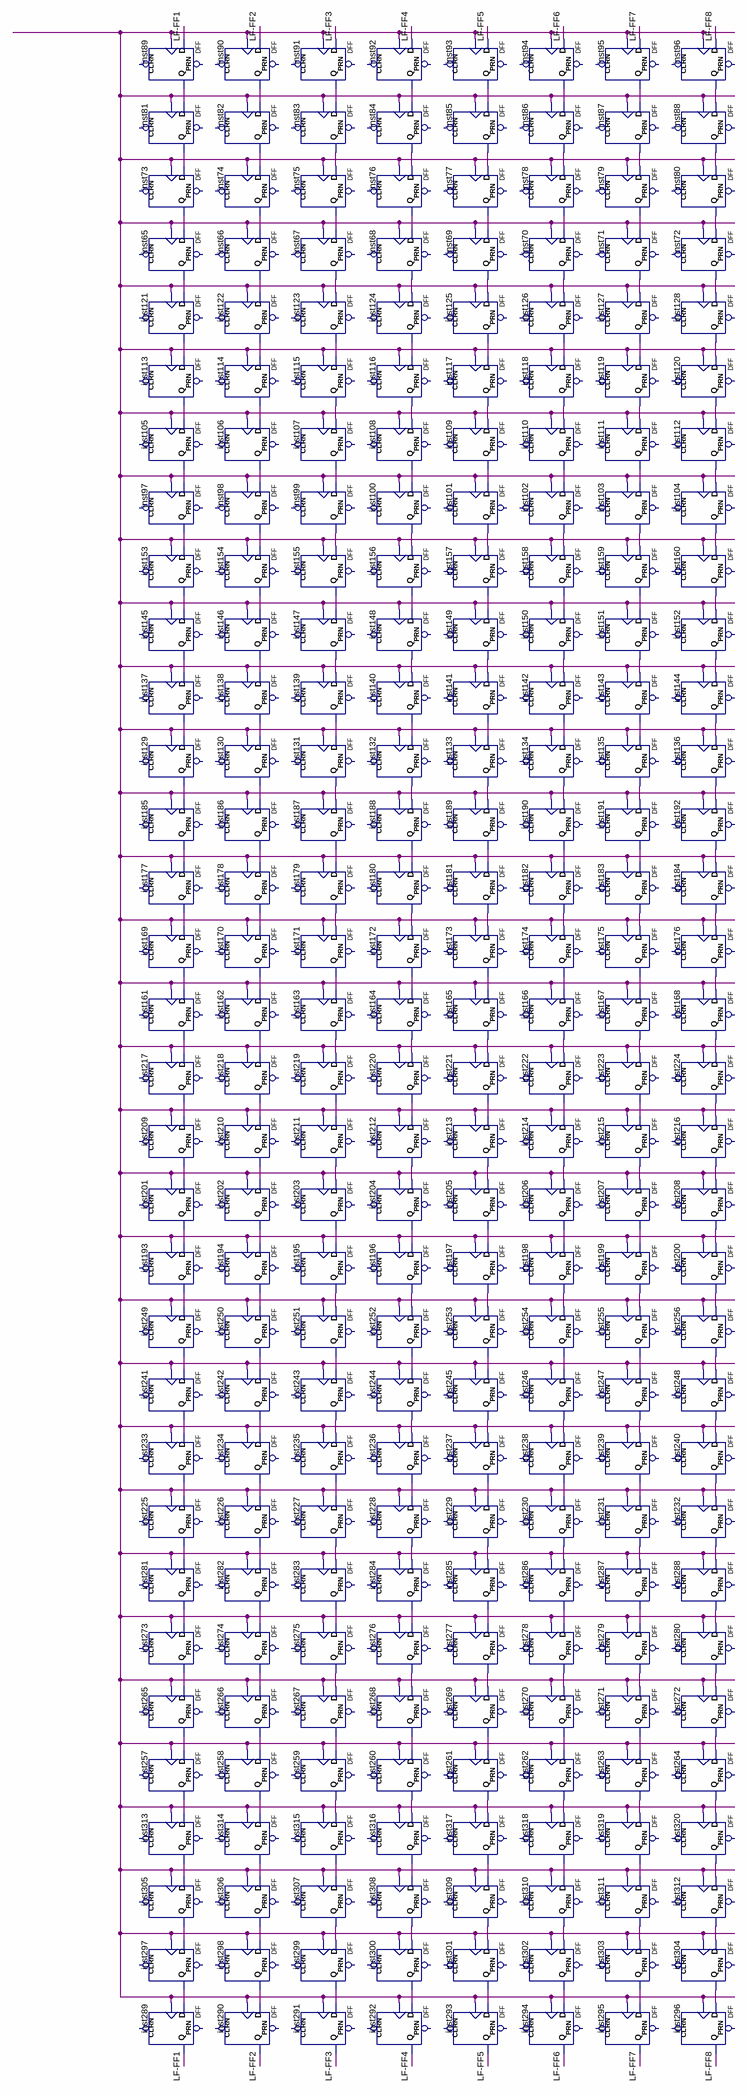
[diagram p0: schematic sheet]
// Quartus schematic Pistabdf.bdf as structural Verilog: 256 symbols, 0 pins
module Pistabdf (
);

  wire inst65_q, inst66_q, inst67_q, inst68_q, inst69_q, inst70_q, inst71_q, inst72_q, inst73_q, inst74_q,
       inst75_q, inst76_q, inst77_q, inst78_q, inst79_q, inst80_q, inst81_q, inst82_q, inst83_q, inst84_q,
       inst85_q, inst86_q, inst87_q, inst88_q, inst89_q, inst90_q, inst91_q, inst92_q, inst93_q, inst94_q,
       inst95_q, inst96_q, inst97_q, inst98_q, inst99_q, inst100_q, inst101_q, inst102_q, inst103_q,
       inst104_q, inst105_q, inst106_q, inst107_q, inst108_q, inst109_q, inst110_q, inst111_q, inst112_q,
       inst113_q, inst114_q, inst115_q, inst116_q, inst117_q, inst118_q, inst119_q, inst120_q, inst121_q,
       inst122_q, inst123_q, inst124_q, inst125_q, inst126_q, inst127_q, inst128_q, inst129_q, inst130_q,
       inst131_q, inst132_q, inst133_q, inst134_q, inst135_q, inst136_q, inst137_q, inst138_q, inst139_q,
       inst140_q, inst141_q, inst142_q, inst143_q, inst144_q, inst145_q, inst146_q, inst147_q, inst148_q,
       inst149_q, inst150_q, inst151_q, inst152_q, inst153_q, inst154_q, inst155_q, inst156_q, inst157_q,
       inst158_q, inst159_q, inst160_q, inst161_q, inst162_q, inst163_q, inst164_q, inst165_q, inst166_q,
       inst167_q, inst168_q, inst169_q, inst170_q, inst171_q, inst172_q, inst173_q, inst174_q, inst175_q,
       inst176_q, inst177_q, inst178_q, inst179_q, inst180_q, inst181_q, inst182_q, inst183_q, inst184_q,
       inst185_q, inst186_q, inst187_q, inst188_q, inst189_q, inst190_q, inst191_q, inst192_q, inst193_q,
       inst194_q, inst195_q, inst196_q, inst197_q, inst198_q, inst199_q, inst200_q, inst201_q, inst202_q,
       inst203_q, inst204_q, inst205_q, inst206_q, inst207_q, inst208_q, inst209_q, inst210_q, inst211_q,
       inst212_q, inst213_q, inst214_q, inst215_q, inst216_q, inst217_q, inst218_q, inst219_q, inst220_q,
       inst221_q, inst222_q, inst223_q, inst224_q, inst225_q, inst226_q, inst227_q, inst228_q, inst229_q,
       inst230_q, inst231_q, inst232_q, inst233_q, inst234_q, inst235_q, inst236_q, inst237_q, inst238_q,
       inst239_q, inst240_q, inst241_q, inst242_q, inst243_q, inst244_q, inst245_q, inst246_q, inst247_q,
       inst248_q, inst249_q, inst250_q, inst251_q, inst252_q, inst253_q, inst254_q, inst255_q, inst256_q,
       inst257_q, inst258_q, inst259_q, inst260_q, inst261_q, inst262_q, inst263_q, inst264_q, inst265_q,
       inst266_q, inst267_q, inst268_q, inst269_q, inst270_q, inst271_q, inst272_q, inst273_q, inst274_q,
       inst275_q, inst276_q, inst277_q, inst278_q, inst279_q, inst280_q, inst281_q, inst282_q, inst283_q,
       inst284_q, inst285_q, inst286_q, inst287_q, inst288_q, inst297_q, inst298_q, inst299_q, inst300_q,
       inst301_q, inst302_q, inst303_q, inst304_q, inst305_q, inst306_q, inst307_q, inst308_q, inst309_q,
       inst310_q, inst311_q, inst312_q, inst313_q, inst314_q, inst315_q, inst316_q, inst317_q, inst318_q,
       inst319_q, inst320_q, \LF-FF1 , \LF-FF2 , \LF-FF3 , \LF-FF4 , \LF-FF5 , \LF-FF6 , \LF-FF7 , \LF-FF8 ,
       undriven;

  DFF inst89 (.CLK(undriven), .D(\LF-FF1 ), .Q(inst89_q));  // open: CLRN, PRN
  DFF inst81 (.CLK(undriven), .D(inst89_q), .Q(inst81_q));  // open: CLRN, PRN
  DFF inst73 (.CLK(undriven), .D(inst81_q), .Q(inst73_q));  // open: CLRN, PRN
  DFF inst65 (.CLK(undriven), .D(inst73_q), .Q(inst65_q));  // open: CLRN, PRN
  DFF inst121 (.CLK(undriven), .D(inst65_q), .Q(inst121_q));  // open: CLRN, PRN
  DFF inst113 (.CLK(undriven), .D(inst121_q), .Q(inst113_q));  // open: CLRN, PRN
  DFF inst105 (.CLK(undriven), .D(inst113_q), .Q(inst105_q));  // open: CLRN, PRN
  DFF inst97 (.CLK(undriven), .D(inst105_q), .Q(inst97_q));  // open: CLRN, PRN
  DFF inst153 (.CLK(undriven), .D(inst97_q), .Q(inst153_q));  // open: CLRN, PRN
  DFF inst145 (.CLK(undriven), .D(inst153_q), .Q(inst145_q));  // open: CLRN, PRN
  DFF inst137 (.CLK(undriven), .D(inst145_q), .Q(inst137_q));  // open: CLRN, PRN
  DFF inst129 (.CLK(undriven), .D(inst137_q), .Q(inst129_q));  // open: CLRN, PRN
  DFF inst185 (.CLK(undriven), .D(inst129_q), .Q(inst185_q));  // open: CLRN, PRN
  DFF inst177 (.CLK(undriven), .D(inst185_q), .Q(inst177_q));  // open: CLRN, PRN
  DFF inst169 (.CLK(undriven), .D(inst177_q), .Q(inst169_q));  // open: CLRN, PRN
  DFF inst161 (.CLK(undriven), .D(inst169_q), .Q(inst161_q));  // open: CLRN, PRN
  DFF inst217 (.CLK(undriven), .D(inst161_q), .Q(inst217_q));  // open: CLRN, PRN
  DFF inst209 (.CLK(undriven), .D(inst217_q), .Q(inst209_q));  // open: CLRN, PRN
  DFF inst201 (.CLK(undriven), .D(inst209_q), .Q(inst201_q));  // open: CLRN, PRN
  DFF inst193 (.CLK(undriven), .D(inst201_q), .Q(inst193_q));  // open: CLRN, PRN
  DFF inst249 (.CLK(undriven), .D(inst193_q), .Q(inst249_q));  // open: CLRN, PRN
  DFF inst241 (.CLK(undriven), .D(inst249_q), .Q(inst241_q));  // open: CLRN, PRN
  DFF inst233 (.CLK(undriven), .D(inst241_q), .Q(inst233_q));  // open: CLRN, PRN
  DFF inst225 (.CLK(undriven), .D(inst233_q), .Q(inst225_q));  // open: CLRN, PRN
  DFF inst281 (.CLK(undriven), .D(inst225_q), .Q(inst281_q));  // open: CLRN, PRN
  DFF inst273 (.CLK(undriven), .D(inst281_q), .Q(inst273_q));  // open: CLRN, PRN
  DFF inst265 (.CLK(undriven), .D(inst273_q), .Q(inst265_q));  // open: CLRN, PRN
  DFF inst257 (.CLK(undriven), .D(inst265_q), .Q(inst257_q));  // open: CLRN, PRN
  DFF inst313 (.CLK(undriven), .D(inst257_q), .Q(inst313_q));  // open: CLRN, PRN
  DFF inst305 (.CLK(undriven), .D(inst313_q), .Q(inst305_q));  // open: CLRN, PRN
  DFF inst297 (.CLK(undriven), .D(inst305_q), .Q(inst297_q));  // open: CLRN, PRN
  DFF inst289 (.CLK(undriven), .D(inst297_q), .Q(\LF-FF1 ));  // open: CLRN, PRN
  DFF inst90 (.CLK(undriven), .D(\LF-FF2 ), .Q(inst90_q));  // open: CLRN, PRN
  DFF inst82 (.CLK(undriven), .D(inst90_q), .Q(inst82_q));  // open: CLRN, PRN
  DFF inst74 (.CLK(undriven), .D(inst82_q), .Q(inst74_q));  // open: CLRN, PRN
  DFF inst66 (.CLK(undriven), .D(inst74_q), .Q(inst66_q));  // open: CLRN, PRN
  DFF inst122 (.CLK(undriven), .D(inst66_q), .Q(inst122_q));  // open: CLRN, PRN
  DFF inst114 (.CLK(undriven), .D(inst122_q), .Q(inst114_q));  // open: CLRN, PRN
  DFF inst106 (.CLK(undriven), .D(inst114_q), .Q(inst106_q));  // open: CLRN, PRN
  DFF inst98 (.CLK(undriven), .D(inst106_q), .Q(inst98_q));  // open: CLRN, PRN
  DFF inst154 (.CLK(undriven), .D(inst98_q), .Q(inst154_q));  // open: CLRN, PRN
  DFF inst146 (.CLK(undriven), .D(inst154_q), .Q(inst146_q));  // open: CLRN, PRN
  DFF inst138 (.CLK(undriven), .D(inst146_q), .Q(inst138_q));  // open: CLRN, PRN
  DFF inst130 (.CLK(undriven), .D(inst138_q), .Q(inst130_q));  // open: CLRN, PRN
  DFF inst186 (.CLK(undriven), .D(inst130_q), .Q(inst186_q));  // open: CLRN, PRN
  DFF inst178 (.CLK(undriven), .D(inst186_q), .Q(inst178_q));  // open: CLRN, PRN
  DFF inst170 (.CLK(undriven), .D(inst178_q), .Q(inst170_q));  // open: CLRN, PRN
  DFF inst162 (.CLK(undriven), .D(inst170_q), .Q(inst162_q));  // open: CLRN, PRN
  DFF inst218 (.CLK(undriven), .D(inst162_q), .Q(inst218_q));  // open: CLRN, PRN
  DFF inst210 (.CLK(undriven), .D(inst218_q), .Q(inst210_q));  // open: CLRN, PRN
  DFF inst202 (.CLK(undriven), .D(inst210_q), .Q(inst202_q));  // open: CLRN, PRN
  DFF inst194 (.CLK(undriven), .D(inst202_q), .Q(inst194_q));  // open: CLRN, PRN
  DFF inst250 (.CLK(undriven), .D(inst194_q), .Q(inst250_q));  // open: CLRN, PRN
  DFF inst242 (.CLK(undriven), .D(inst250_q), .Q(inst242_q));  // open: CLRN, PRN
  DFF inst234 (.CLK(undriven), .D(inst242_q), .Q(inst234_q));  // open: CLRN, PRN
  DFF inst226 (.CLK(undriven), .D(inst234_q), .Q(inst226_q));  // open: CLRN, PRN
  DFF inst282 (.CLK(undriven), .D(inst226_q), .Q(inst282_q));  // open: CLRN, PRN
  DFF inst274 (.CLK(undriven), .D(inst282_q), .Q(inst274_q));  // open: CLRN, PRN
  DFF inst266 (.CLK(undriven), .D(inst274_q), .Q(inst266_q));  // open: CLRN, PRN
  DFF inst258 (.CLK(undriven), .D(inst266_q), .Q(inst258_q));  // open: CLRN, PRN
  DFF inst314 (.CLK(undriven), .D(inst258_q), .Q(inst314_q));  // open: CLRN, PRN
  DFF inst306 (.CLK(undriven), .D(inst314_q), .Q(inst306_q));  // open: CLRN, PRN
  DFF inst298 (.CLK(undriven), .D(inst306_q), .Q(inst298_q));  // open: CLRN, PRN
  DFF inst290 (.CLK(undriven), .D(inst298_q), .Q(\LF-FF2 ));  // open: CLRN, PRN
  DFF inst91 (.CLK(undriven), .D(\LF-FF3 ), .Q(inst91_q));  // open: CLRN, PRN
  DFF inst83 (.CLK(undriven), .D(inst91_q), .Q(inst83_q));  // open: CLRN, PRN
  DFF inst75 (.CLK(undriven), .D(inst83_q), .Q(inst75_q));  // open: CLRN, PRN
  DFF inst67 (.CLK(undriven), .D(inst75_q), .Q(inst67_q));  // open: CLRN, PRN
  DFF inst123 (.CLK(undriven), .D(inst67_q), .Q(inst123_q));  // open: CLRN, PRN
  DFF inst115 (.CLK(undriven), .D(inst123_q), .Q(inst115_q));  // open: CLRN, PRN
  DFF inst107 (.CLK(undriven), .D(inst115_q), .Q(inst107_q));  // open: CLRN, PRN
  DFF inst99 (.CLK(undriven), .D(inst107_q), .Q(inst99_q));  // open: CLRN, PRN
  DFF inst155 (.CLK(undriven), .D(inst99_q), .Q(inst155_q));  // open: CLRN, PRN
  DFF inst147 (.CLK(undriven), .D(inst155_q), .Q(inst147_q));  // open: CLRN, PRN
  DFF inst139 (.CLK(undriven), .D(inst147_q), .Q(inst139_q));  // open: CLRN, PRN
  DFF inst131 (.CLK(undriven), .D(inst139_q), .Q(inst131_q));  // open: CLRN, PRN
  DFF inst187 (.CLK(undriven), .D(inst131_q), .Q(inst187_q));  // open: CLRN, PRN
  DFF inst179 (.CLK(undriven), .D(inst187_q), .Q(inst179_q));  // open: CLRN, PRN
  DFF inst171 (.CLK(undriven), .D(inst179_q), .Q(inst171_q));  // open: CLRN, PRN
  DFF inst163 (.CLK(undriven), .D(inst171_q), .Q(inst163_q));  // open: CLRN, PRN
  DFF inst219 (.CLK(undriven), .D(inst163_q), .Q(inst219_q));  // open: CLRN, PRN
  DFF inst211 (.CLK(undriven), .D(inst219_q), .Q(inst211_q));  // open: CLRN, PRN
  DFF inst203 (.CLK(undriven), .D(inst211_q), .Q(inst203_q));  // open: CLRN, PRN
  DFF inst195 (.CLK(undriven), .D(inst203_q), .Q(inst195_q));  // open: CLRN, PRN
  DFF inst251 (.CLK(undriven), .D(inst195_q), .Q(inst251_q));  // open: CLRN, PRN
  DFF inst243 (.CLK(undriven), .D(inst251_q), .Q(inst243_q));  // open: CLRN, PRN
  DFF inst235 (.CLK(undriven), .D(inst243_q), .Q(inst235_q));  // open: CLRN, PRN
  DFF inst227 (.CLK(undriven), .D(inst235_q), .Q(inst227_q));  // open: CLRN, PRN
  DFF inst283 (.CLK(undriven), .D(inst227_q), .Q(inst283_q));  // open: CLRN, PRN
  DFF inst275 (.CLK(undriven), .D(inst283_q), .Q(inst275_q));  // open: CLRN, PRN
  DFF inst267 (.CLK(undriven), .D(inst275_q), .Q(inst267_q));  // open: CLRN, PRN
  DFF inst259 (.CLK(undriven), .D(inst267_q), .Q(inst259_q));  // open: CLRN, PRN
  DFF inst315 (.CLK(undriven), .D(inst259_q), .Q(inst315_q));  // open: CLRN, PRN
  DFF inst307 (.CLK(undriven), .D(inst315_q), .Q(inst307_q));  // open: CLRN, PRN
  DFF inst299 (.CLK(undriven), .D(inst307_q), .Q(inst299_q));  // open: CLRN, PRN
  DFF inst291 (.CLK(undriven), .D(inst299_q), .Q(\LF-FF3 ));  // open: CLRN, PRN
  DFF inst92 (.CLK(undriven), .D(\LF-FF4 ), .Q(inst92_q));  // open: CLRN, PRN
  DFF inst84 (.CLK(undriven), .D(inst92_q), .Q(inst84_q));  // open: CLRN, PRN
  DFF inst76 (.CLK(undriven), .D(inst84_q), .Q(inst76_q));  // open: CLRN, PRN
  DFF inst68 (.CLK(undriven), .D(inst76_q), .Q(inst68_q));  // open: CLRN, PRN
  DFF inst124 (.CLK(undriven), .D(inst68_q), .Q(inst124_q));  // open: CLRN, PRN
  DFF inst116 (.CLK(undriven), .D(inst124_q), .Q(inst116_q));  // open: CLRN, PRN
  DFF inst108 (.CLK(undriven), .D(inst116_q), .Q(inst108_q));  // open: CLRN, PRN
  DFF inst100 (.CLK(undriven), .D(inst108_q), .Q(inst100_q));  // open: CLRN, PRN
  DFF inst156 (.CLK(undriven), .D(inst100_q), .Q(inst156_q));  // open: CLRN, PRN
  DFF inst148 (.CLK(undriven), .D(inst156_q), .Q(inst148_q));  // open: CLRN, PRN
  DFF inst140 (.CLK(undriven), .D(inst148_q), .Q(inst140_q));  // open: CLRN, PRN
  DFF inst132 (.CLK(undriven), .D(inst140_q), .Q(inst132_q));  // open: CLRN, PRN
  DFF inst188 (.CLK(undriven), .D(inst132_q), .Q(inst188_q));  // open: CLRN, PRN
  DFF inst180 (.CLK(undriven), .D(inst188_q), .Q(inst180_q));  // open: CLRN, PRN
  DFF inst172 (.CLK(undriven), .D(inst180_q), .Q(inst172_q));  // open: CLRN, PRN
  DFF inst164 (.CLK(undriven), .D(inst172_q), .Q(inst164_q));  // open: CLRN, PRN
  DFF inst220 (.CLK(undriven), .D(inst164_q), .Q(inst220_q));  // open: CLRN, PRN
  DFF inst212 (.CLK(undriven), .D(inst220_q), .Q(inst212_q));  // open: CLRN, PRN
  DFF inst204 (.CLK(undriven), .D(inst212_q), .Q(inst204_q));  // open: CLRN, PRN
  DFF inst196 (.CLK(undriven), .D(inst204_q), .Q(inst196_q));  // open: CLRN, PRN
  DFF inst252 (.CLK(undriven), .D(inst196_q), .Q(inst252_q));  // open: CLRN, PRN
  DFF inst244 (.CLK(undriven), .D(inst252_q), .Q(inst244_q));  // open: CLRN, PRN
  DFF inst236 (.CLK(undriven), .D(inst244_q), .Q(inst236_q));  // open: CLRN, PRN
  DFF inst228 (.CLK(undriven), .D(inst236_q), .Q(inst228_q));  // open: CLRN, PRN
  DFF inst284 (.CLK(undriven), .D(inst228_q), .Q(inst284_q));  // open: CLRN, PRN
  DFF inst276 (.CLK(undriven), .D(inst284_q), .Q(inst276_q));  // open: CLRN, PRN
  DFF inst268 (.CLK(undriven), .D(inst276_q), .Q(inst268_q));  // open: CLRN, PRN
  DFF inst260 (.CLK(undriven), .D(inst268_q), .Q(inst260_q));  // open: CLRN, PRN
  DFF inst316 (.CLK(undriven), .D(inst260_q), .Q(inst316_q));  // open: CLRN, PRN
  DFF inst308 (.CLK(undriven), .D(inst316_q), .Q(inst308_q));  // open: CLRN, PRN
  DFF inst300 (.CLK(undriven), .D(inst308_q), .Q(inst300_q));  // open: CLRN, PRN
  DFF inst292 (.CLK(undriven), .D(inst300_q), .Q(\LF-FF4 ));  // open: CLRN, PRN
  DFF inst93 (.CLK(undriven), .D(\LF-FF5 ), .Q(inst93_q));  // open: CLRN, PRN
  DFF inst85 (.CLK(undriven), .D(inst93_q), .Q(inst85_q));  // open: CLRN, PRN
  DFF inst77 (.CLK(undriven), .D(inst85_q), .Q(inst77_q));  // open: CLRN, PRN
  DFF inst69 (.CLK(undriven), .D(inst77_q), .Q(inst69_q));  // open: CLRN, PRN
  DFF inst125 (.CLK(undriven), .D(inst69_q), .Q(inst125_q));  // open: CLRN, PRN
  DFF inst117 (.CLK(undriven), .D(inst125_q), .Q(inst117_q));  // open: CLRN, PRN
  DFF inst109 (.CLK(undriven), .D(inst117_q), .Q(inst109_q));  // open: CLRN, PRN
  DFF inst101 (.CLK(undriven), .D(inst109_q), .Q(inst101_q));  // open: CLRN, PRN
  DFF inst157 (.CLK(undriven), .D(inst101_q), .Q(inst157_q));  // open: CLRN, PRN
  DFF inst149 (.CLK(undriven), .D(inst157_q), .Q(inst149_q));  // open: CLRN, PRN
  DFF inst141 (.CLK(undriven), .D(inst149_q), .Q(inst141_q));  // open: CLRN, PRN
  DFF inst133 (.CLK(undriven), .D(inst141_q), .Q(inst133_q));  // open: CLRN, PRN
  DFF inst189 (.CLK(undriven), .D(inst133_q), .Q(inst189_q));  // open: CLRN, PRN
  DFF inst181 (.CLK(undriven), .D(inst189_q), .Q(inst181_q));  // open: CLRN, PRN
  DFF inst173 (.CLK(undriven), .D(inst181_q), .Q(inst173_q));  // open: CLRN, PRN
  DFF inst165 (.CLK(undriven), .D(inst173_q), .Q(inst165_q));  // open: CLRN, PRN
  DFF inst221 (.CLK(undriven), .D(inst165_q), .Q(inst221_q));  // open: CLRN, PRN
  DFF inst213 (.CLK(undriven), .D(inst221_q), .Q(inst213_q));  // open: CLRN, PRN
  DFF inst205 (.CLK(undriven), .D(inst213_q), .Q(inst205_q));  // open: CLRN, PRN
  DFF inst197 (.CLK(undriven), .D(inst205_q), .Q(inst197_q));  // open: CLRN, PRN
  DFF inst253 (.CLK(undriven), .D(inst197_q), .Q(inst253_q));  // open: CLRN, PRN
  DFF inst245 (.CLK(undriven), .D(inst253_q), .Q(inst245_q));  // open: CLRN, PRN
  DFF inst237 (.CLK(undriven), .D(inst245_q), .Q(inst237_q));  // open: CLRN, PRN
  DFF inst229 (.CLK(undriven), .D(inst237_q), .Q(inst229_q));  // open: CLRN, PRN
  DFF inst285 (.CLK(undriven), .D(inst229_q), .Q(inst285_q));  // open: CLRN, PRN
  DFF inst277 (.CLK(undriven), .D(inst285_q), .Q(inst277_q));  // open: CLRN, PRN
  DFF inst269 (.CLK(undriven), .D(inst277_q), .Q(inst269_q));  // open: CLRN, PRN
  DFF inst261 (.CLK(undriven), .D(inst269_q), .Q(inst261_q));  // open: CLRN, PRN
  DFF inst317 (.CLK(undriven), .D(inst261_q), .Q(inst317_q));  // open: CLRN, PRN
  DFF inst309 (.CLK(undriven), .D(inst317_q), .Q(inst309_q));  // open: CLRN, PRN
  DFF inst301 (.CLK(undriven), .D(inst309_q), .Q(inst301_q));  // open: CLRN, PRN
  DFF inst293 (.CLK(undriven), .D(inst301_q), .Q(\LF-FF5 ));  // open: CLRN, PRN
  DFF inst94 (.CLK(undriven), .D(\LF-FF6 ), .Q(inst94_q));  // open: CLRN, PRN
  DFF inst86 (.CLK(undriven), .D(inst94_q), .Q(inst86_q));  // open: CLRN, PRN
  DFF inst78 (.CLK(undriven), .D(inst86_q), .Q(inst78_q));  // open: CLRN, PRN
  DFF inst70 (.CLK(undriven), .D(inst78_q), .Q(inst70_q));  // open: CLRN, PRN
  DFF inst126 (.CLK(undriven), .D(inst70_q), .Q(inst126_q));  // open: CLRN, PRN
  DFF inst118 (.CLK(undriven), .D(inst126_q), .Q(inst118_q));  // open: CLRN, PRN
  DFF inst110 (.CLK(undriven), .D(inst118_q), .Q(inst110_q));  // open: CLRN, PRN
  DFF inst102 (.CLK(undriven), .D(inst110_q), .Q(inst102_q));  // open: CLRN, PRN
  DFF inst158 (.CLK(undriven), .D(inst102_q), .Q(inst158_q));  // open: CLRN, PRN
  DFF inst150 (.CLK(undriven), .D(inst158_q), .Q(inst150_q));  // open: CLRN, PRN
  DFF inst142 (.CLK(undriven), .D(inst150_q), .Q(inst142_q));  // open: CLRN, PRN
  DFF inst134 (.CLK(undriven), .D(inst142_q), .Q(inst134_q));  // open: CLRN, PRN
  DFF inst190 (.CLK(undriven), .D(inst134_q), .Q(inst190_q));  // open: CLRN, PRN
  DFF inst182 (.CLK(undriven), .D(inst190_q), .Q(inst182_q));  // open: CLRN, PRN
  DFF inst174 (.CLK(undriven), .D(inst182_q), .Q(inst174_q));  // open: CLRN, PRN
  DFF inst166 (.CLK(undriven), .D(inst174_q), .Q(inst166_q));  // open: CLRN, PRN
  DFF inst222 (.CLK(undriven), .D(inst166_q), .Q(inst222_q));  // open: CLRN, PRN
  DFF inst214 (.CLK(undriven), .D(inst222_q), .Q(inst214_q));  // open: CLRN, PRN
  DFF inst206 (.CLK(undriven), .D(inst214_q), .Q(inst206_q));  // open: CLRN, PRN
  DFF inst198 (.CLK(undriven), .D(inst206_q), .Q(inst198_q));  // open: CLRN, PRN
  DFF inst254 (.CLK(undriven), .D(inst198_q), .Q(inst254_q));  // open: CLRN, PRN
  DFF inst246 (.CLK(undriven), .D(inst254_q), .Q(inst246_q));  // open: CLRN, PRN
  DFF inst238 (.CLK(undriven), .D(inst246_q), .Q(inst238_q));  // open: CLRN, PRN
  DFF inst230 (.CLK(undriven), .D(inst238_q), .Q(inst230_q));  // open: CLRN, PRN
  DFF inst286 (.CLK(undriven), .D(inst230_q), .Q(inst286_q));  // open: CLRN, PRN
  DFF inst278 (.CLK(undriven), .D(inst286_q), .Q(inst278_q));  // open: CLRN, PRN
  DFF inst270 (.CLK(undriven), .D(inst278_q), .Q(inst270_q));  // open: CLRN, PRN
  DFF inst262 (.CLK(undriven), .D(inst270_q), .Q(inst262_q));  // open: CLRN, PRN
  DFF inst318 (.CLK(undriven), .D(inst262_q), .Q(inst318_q));  // open: CLRN, PRN
  DFF inst310 (.CLK(undriven), .D(inst318_q), .Q(inst310_q));  // open: CLRN, PRN
  DFF inst302 (.CLK(undriven), .D(inst310_q), .Q(inst302_q));  // open: CLRN, PRN
  DFF inst294 (.CLK(undriven), .D(inst302_q), .Q(\LF-FF6 ));  // open: CLRN, PRN
  DFF inst95 (.CLK(undriven), .D(\LF-FF7 ), .Q(inst95_q));  // open: CLRN, PRN
  DFF inst87 (.CLK(undriven), .D(inst95_q), .Q(inst87_q));  // open: CLRN, PRN
  DFF inst79 (.CLK(undriven), .D(inst87_q), .Q(inst79_q));  // open: CLRN, PRN
  DFF inst71 (.CLK(undriven), .D(inst79_q), .Q(inst71_q));  // open: CLRN, PRN
  DFF inst127 (.CLK(undriven), .D(inst71_q), .Q(inst127_q));  // open: CLRN, PRN
  DFF inst119 (.CLK(undriven), .D(inst127_q), .Q(inst119_q));  // open: CLRN, PRN
  DFF inst111 (.CLK(undriven), .D(inst119_q), .Q(inst111_q));  // open: CLRN, PRN
  DFF inst103 (.CLK(undriven), .D(inst111_q), .Q(inst103_q));  // open: CLRN, PRN
  DFF inst159 (.CLK(undriven), .D(inst103_q), .Q(inst159_q));  // open: CLRN, PRN
  DFF inst151 (.CLK(undriven), .D(inst159_q), .Q(inst151_q));  // open: CLRN, PRN
  DFF inst143 (.CLK(undriven), .D(inst151_q), .Q(inst143_q));  // open: CLRN, PRN
  DFF inst135 (.CLK(undriven), .D(inst143_q), .Q(inst135_q));  // open: CLRN, PRN
  DFF inst191 (.CLK(undriven), .D(inst135_q), .Q(inst191_q));  // open: CLRN, PRN
  DFF inst183 (.CLK(undriven), .D(inst191_q), .Q(inst183_q));  // open: CLRN, PRN
  DFF inst175 (.CLK(undriven), .D(inst183_q), .Q(inst175_q));  // open: CLRN, PRN
  DFF inst167 (.CLK(undriven), .D(inst175_q), .Q(inst167_q));  // open: CLRN, PRN
  DFF inst223 (.CLK(undriven), .D(inst167_q), .Q(inst223_q));  // open: CLRN, PRN
  DFF inst215 (.CLK(undriven), .D(inst223_q), .Q(inst215_q));  // open: CLRN, PRN
  DFF inst207 (.CLK(undriven), .D(inst215_q), .Q(inst207_q));  // open: CLRN, PRN
  DFF inst199 (.CLK(undriven), .D(inst207_q), .Q(inst199_q));  // open: CLRN, PRN
  DFF inst255 (.CLK(undriven), .D(inst199_q), .Q(inst255_q));  // open: CLRN, PRN
  DFF inst247 (.CLK(undriven), .D(inst255_q), .Q(inst247_q));  // open: CLRN, PRN
  DFF inst239 (.CLK(undriven), .D(inst247_q), .Q(inst239_q));  // open: CLRN, PRN
  DFF inst231 (.CLK(undriven), .D(inst239_q), .Q(inst231_q));  // open: CLRN, PRN
  DFF inst287 (.CLK(undriven), .D(inst231_q), .Q(inst287_q));  // open: CLRN, PRN
  DFF inst279 (.CLK(undriven), .D(inst287_q), .Q(inst279_q));  // open: CLRN, PRN
  DFF inst271 (.CLK(undriven), .D(inst279_q), .Q(inst271_q));  // open: CLRN, PRN
  DFF inst263 (.CLK(undriven), .D(inst271_q), .Q(inst263_q));  // open: CLRN, PRN
  DFF inst319 (.CLK(undriven), .D(inst263_q), .Q(inst319_q));  // open: CLRN, PRN
  DFF inst311 (.CLK(undriven), .D(inst319_q), .Q(inst311_q));  // open: CLRN, PRN
  DFF inst303 (.CLK(undriven), .D(inst311_q), .Q(inst303_q));  // open: CLRN, PRN
  DFF inst295 (.CLK(undriven), .D(inst303_q), .Q(\LF-FF7 ));  // open: CLRN, PRN
  DFF inst96 (.CLK(undriven), .D(\LF-FF8 ), .Q(inst96_q));  // open: CLRN, PRN
  DFF inst88 (.CLK(undriven), .D(inst96_q), .Q(inst88_q));  // open: CLRN, PRN
  DFF inst80 (.CLK(undriven), .D(inst88_q), .Q(inst80_q));  // open: CLRN, PRN
  DFF inst72 (.CLK(undriven), .D(inst80_q), .Q(inst72_q));  // open: CLRN, PRN
  DFF inst128 (.CLK(undriven), .D(inst72_q), .Q(inst128_q));  // open: CLRN, PRN
  DFF inst120 (.CLK(undriven), .D(inst128_q), .Q(inst120_q));  // open: CLRN, PRN
  DFF inst112 (.CLK(undriven), .D(inst120_q), .Q(inst112_q));  // open: CLRN, PRN
  DFF inst104 (.CLK(undriven), .D(inst112_q), .Q(inst104_q));  // open: CLRN, PRN
  DFF inst160 (.CLK(undriven), .D(inst104_q), .Q(inst160_q));  // open: CLRN, PRN
  DFF inst152 (.CLK(undriven), .D(inst160_q), .Q(inst152_q));  // open: CLRN, PRN
  DFF inst144 (.CLK(undriven), .D(inst152_q), .Q(inst144_q));  // open: CLRN, PRN
  DFF inst136 (.CLK(undriven), .D(inst144_q), .Q(inst136_q));  // open: CLRN, PRN
  DFF inst192 (.CLK(undriven), .D(inst136_q), .Q(inst192_q));  // open: CLRN, PRN
  DFF inst184 (.CLK(undriven), .D(inst192_q), .Q(inst184_q));  // open: CLRN, PRN
  DFF inst176 (.CLK(undriven), .D(inst184_q), .Q(inst176_q));  // open: CLRN, PRN
  DFF inst168 (.CLK(undriven), .D(inst176_q), .Q(inst168_q));  // open: CLRN, PRN
  DFF inst224 (.CLK(undriven), .D(inst168_q), .Q(inst224_q));  // open: CLRN, PRN
  DFF inst216 (.CLK(undriven), .D(inst224_q), .Q(inst216_q));  // open: CLRN, PRN
  DFF inst208 (.CLK(undriven), .D(inst216_q), .Q(inst208_q));  // open: CLRN, PRN
  DFF inst200 (.CLK(undriven), .D(inst208_q), .Q(inst200_q));  // open: CLRN, PRN
  DFF inst256 (.CLK(undriven), .D(inst200_q), .Q(inst256_q));  // open: CLRN, PRN
  DFF inst248 (.CLK(undriven), .D(inst256_q), .Q(inst248_q));  // open: CLRN, PRN
  DFF inst240 (.CLK(undriven), .D(inst248_q), .Q(inst240_q));  // open: CLRN, PRN
  DFF inst232 (.CLK(undriven), .D(inst240_q), .Q(inst232_q));  // open: CLRN, PRN
  DFF inst288 (.CLK(undriven), .D(inst232_q), .Q(inst288_q));  // open: CLRN, PRN
  DFF inst280 (.CLK(undriven), .D(inst288_q), .Q(inst280_q));  // open: CLRN, PRN
  DFF inst272 (.CLK(undriven), .D(inst280_q), .Q(inst272_q));  // open: CLRN, PRN
  DFF inst264 (.CLK(undriven), .D(inst272_q), .Q(inst264_q));  // open: CLRN, PRN
  DFF inst320 (.CLK(undriven), .D(inst264_q), .Q(inst320_q));  // open: CLRN, PRN
  DFF inst312 (.CLK(undriven), .D(inst320_q), .Q(inst312_q));  // open: CLRN, PRN
  DFF inst304 (.CLK(undriven), .D(inst312_q), .Q(inst304_q));  // open: CLRN, PRN
  DFF inst296 (.CLK(undriven), .D(inst304_q), .Q(\LF-FF8 ));  // open: CLRN, PRN
endmodule
